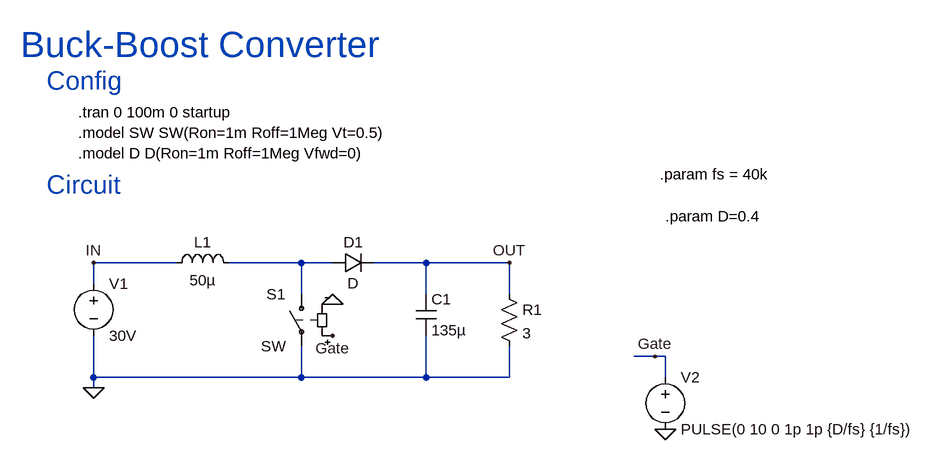
[diagram p0: schematic BoostConverter.asc]
BoostConverter.asc, the LTspice schematic file:
Version 4
SHEET 1 3572 848
WIRE 560 32 432 32
WIRE 752 32 640 32
WIRE 800 32 752 32
WIRE 944 32 864 32
WIRE 1072 32 944 32
WIRE 432 64 432 32
WIRE 752 80 752 32
WIRE 944 80 944 32
WIRE 1072 80 1072 32
WIRE 1296 176 1264 176
WIRE 1312 176 1296 176
WIRE 432 208 432 144
WIRE 752 208 752 160
WIRE 752 208 432 208
WIRE 944 208 944 144
WIRE 944 208 752 208
WIRE 1072 208 1072 160
WIRE 1072 208 944 208
WIRE 1312 208 1312 176
WIRE 432 224 432 208
FLAG 432 224 0
FLAG 800 144 Gate
FLAG 800 96 0
FLAG 432 32 IN
FLAG 1072 32 OUT
FLAG 1296 176 Gate
FLAG 1312 288 0
SYMBOL voltage 432 48 R0
WINDOW 123 0 0 Left 2
WINDOW 39 0 0 Left 2
SYMATTR InstName V1
SYMATTR Value 30V
SYMBOL cap 928 80 R0
SYMATTR InstName C1
SYMATTR Value 135µ
SYMBOL diode 800 48 R270
WINDOW 0 32 32 VTop 2
WINDOW 3 0 32 VBottom 2
SYMATTR InstName D1
SYMBOL res 1056 64 R0
SYMATTR InstName R1
SYMATTR Value 3
SYMBOL ind 544 48 R270
WINDOW 0 32 56 VTop 2
WINDOW 3 5 56 VBottom 2
SYMATTR InstName L1
SYMATTR Value 50µ
SYMBOL sw 752 64 M0
SYMATTR InstName S1
SYMBOL voltage 1312 192 R0
WINDOW 123 0 0 Left 0
WINDOW 39 0 0 Left 0
SYMATTR InstName V2
SYMATTR Value PULSE(0 10 0 1p 1p {D/fs} {1/fs})
TEXT 408 -200 Left 2 !.tran 0 100m 0 startup
TEXT 408 -168 Left 2 !.model SW SW(Ron=1m Roff=1Meg Vt=0.5)\n.model D D(Ron=1m Roff=1Meg Vfwd=0)
TEXT 360 -248 Left 4 ;Config
TEXT 320 -304 Left 5 ;Buck-Boost Converter
TEXT 360 -88 Left 4 ;Circuit
TEXT 1304 -104 Left 2 !.param fs = 40k
TEXT 1312 -40 Left 2 !.param D=0.4

The netlist it stands for:
* BoostConverter.asc
V1 IN 0 30V
C1 OUT 0 135µ
D1 N001 OUT D
R1 OUT 0 3
L1 IN N001 50µ
S1 N001 0 Gate 0 SW
V2 Gate 0 PULSE(0 10 0 1p 1p {D/fs} {1/fs})
.model D D
.lib standard.dio
.tran 0 100m 0 startup
.model SW SW(Ron=1m Roff=1Meg Vt=0.5)
.model D D(Ron=1m Roff=1Meg Vfwd=0)
* Config
* Buck-Boost Converter
* Circuit
.param fs = 40k
.param D=0.4
.backanno
.end